# Altium project PCB_Hoverboard_Project.PrjPcb
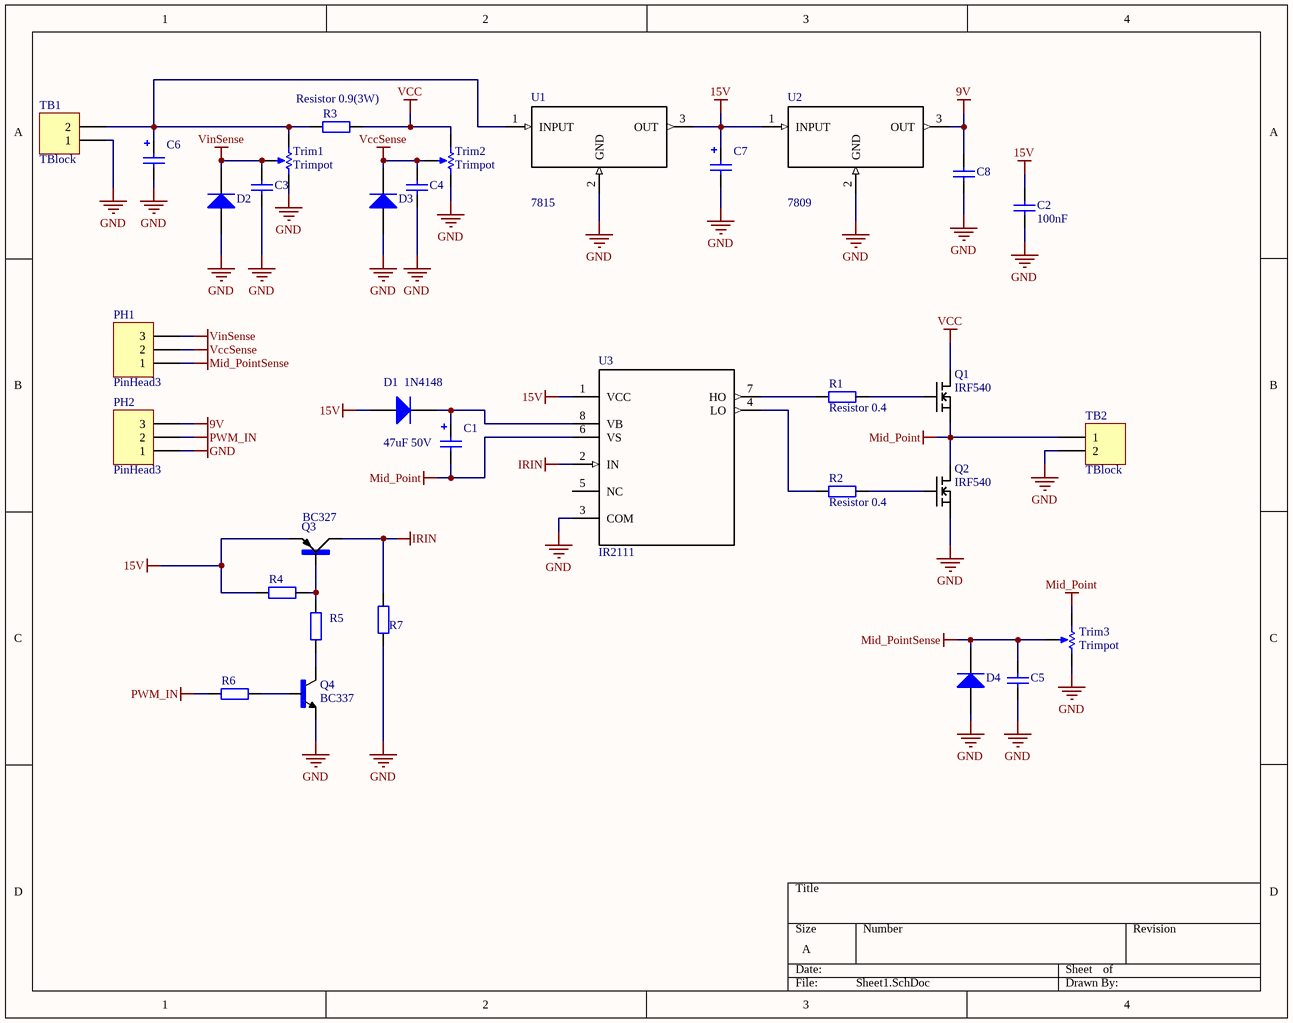
[diagram p0: Sheet1.SchDoc]
1 sheet, 33 parts. Net scope: global (net labels, ports and power ports of the same name join across sheets).
Board file: PCB1.PcbDoc

## Sheet Sheet1.SchDoc
size A

### Parts
C1  47uF 50V  [Capacitor POL 2.2mm(100mil)]
C2  100nF  [Capacitor 100n (cor verniz)]
C3  Capacitor 220nf 63V  [Capacitor NPOL 5mm(200mils)]  (value not drawn)
C4  Capacitor 220nf 63V  [Capacitor NPOL 5mm(200mils)]  (value not drawn)
C5  Capacitor 220nf 63V  [Capacitor NPOL 5mm(200mils)]  (value not drawn)
C6  Capacitor 1000uf 25V  [Capacitor 1000u 25V]  (value not drawn)
C7  Capacitor 220uf 63V  [Capacitor 220uf 63V]  (value not drawn)
C8  Capacitor 220nf 63V  [Capacitor NPOL 5mm(200mils)]  (value not drawn)
D1  1N4148  [Diode 8.89mm(350mils)]
D2  Diode 1N4148  [Diode 8.89mm(350mils)]  (value not drawn)
D3  Diode 1N4148  [Diode 8.89mm(350mils)]  (value not drawn)
D4  Diode 1N4148  [Diode 8.89mm(350mils)]  (value not drawn)
PH1  PinHead3  [PINHEAD3]
PH2  PinHead3  [PINHEAD3]
Q1  IRF540  [IRF540]
Q2  IRF540  [IRF540]
Q3  BC327  [BC327]
Q4  BC337  [BC337]
R1  Resistor 0.4  [Resistor Axial 0.4]
R2  Resistor 0.4  [Resistor Axial 0.4]
R3  Resistor 0.9(3W)  [Resistor Axial 0.9(3W)]
R4  Resistor 0.4  [Resistor Axial 0.4]  (value not drawn)
R5  Resistor 0.4  [Resistor Axial 0.4]  (value not drawn)
R6  Resistor 0.4  [Resistor Axial 0.4]  (value not drawn)
R7  Resistor 0.4  [Resistor Axial 0.4]  (value not drawn)
TB1  TBlock  [TBlock]
TB2  TBlock  [TBlock]
Trim1  Trimpot  [TRIMPOT]
Trim2  Trimpot  [TRIMPOT]
Trim3  Trimpot  [TRIMPOT]
U1  7815  [LM317/337]
U2  7809  [LM317/337]
U3  IR2111  [DIP8]

### Nets
9V: C8.2 PH2.3 U2.3(OUT)
15V: C2.2 C7.2 D1.A Q3.E R4.1 U1.3(OUT) U2.1(INPUT) U3.1(VCC)
GND: C2.1 C3.1 C4.1 C5.1 C6.1 C7.1 C8.1 D2.A D3.A D4.A PH2.1 Q2.3(S) Q4.1(E) R7.1 TB1.1 TB2.2 Trim1.3(BOT) Trim2.3(BOT) Trim3.3(BOT) U1.2(GND) U2.2(GND) U3.3(COM)
IRIN: Q3.C R7.2 U3.2(IN)
Mid_Point: C1.1 Q1.3(S) Q2.2(D) TB2.1 Trim3.1(TOP) U3.6(VS)
Mid_PointSense: C5.2 D4.K PH1.1 Trim3.2(TAP)
PWM_IN: PH2.2 R6.1
VCC: Q1.2(D) R3.2 Trim2.1(TOP)
VccSense: C4.2 D3.K PH1.2 Trim2.2(TAP)
VinSense: C3.2 D2.K PH1.3 Trim1.2(TAP)
NetC1_2: C1.2 D1.K U3.8(VB)
NetC6_2: C6.2 R3.1 TB1.2 Trim1.1(TOP) U1.1(INPUT)
NetQ1_1: Q1.1(G) R1.2
NetQ2_1: Q2.1(G) R2.2
NetQ3_B: Q3.B R4.2 R5.2
NetQ4_2: Q4.2(B) R6.2
NetQ4_3: Q4.3(C) R5.1
NetR1_1: R1.1 U3.7(HO)
NetR2_1: R2.1 U3.4(LO)

Not connected (* = marked no-connect by the designer): U3 5(NC)

### Library data of the parts
C1 = Capacitor 47uF 50V
C2 = Capacitor 100n 250V (Verniz)
D1 = Diode 1N4148
U1 U2 = LM78XX